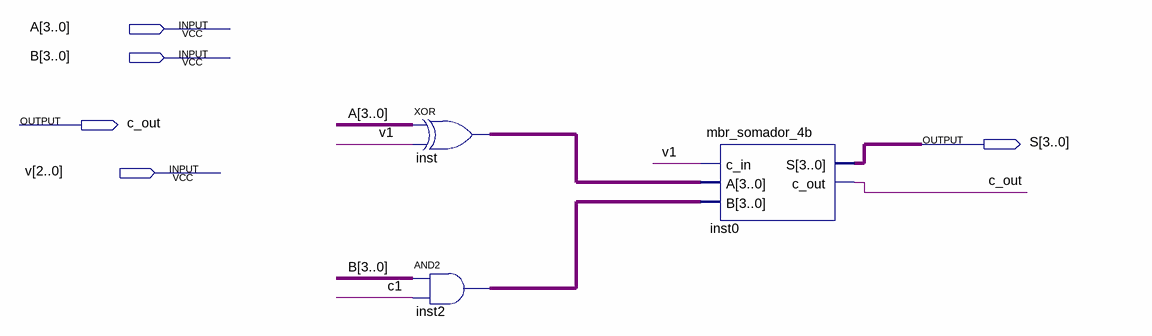
[diagram p0: schematic sheet]
// Quartus schematic mbr_bloco_arit_4b.bdf as structural Verilog: 3 symbols, 5 pins
module mbr_bloco_arit_4b (
  input  [3:0] A,
  input  [3:0] B,
  input  [2:0] v,
  output c_out,
  output [3:0] S
);

  wire c1;
  wire [3:0] inst2_out, inst_out;

  assign inst_out = A ^ {4{v[1]}};  // XOR inst, 4 bits wide
  assign inst2_out = B & {4{c1}};  // AND2 inst2, 4 bits wide
  mbr_somador_4b inst0 (.c_in(v[1]), .A(inst_out), .B(inst2_out), .S(S), .c_out(c_out));
endmodule
